# EAGLE design ft231x-breakout-v11-openSX70versionSEEED (EAGLE 9.1.0)
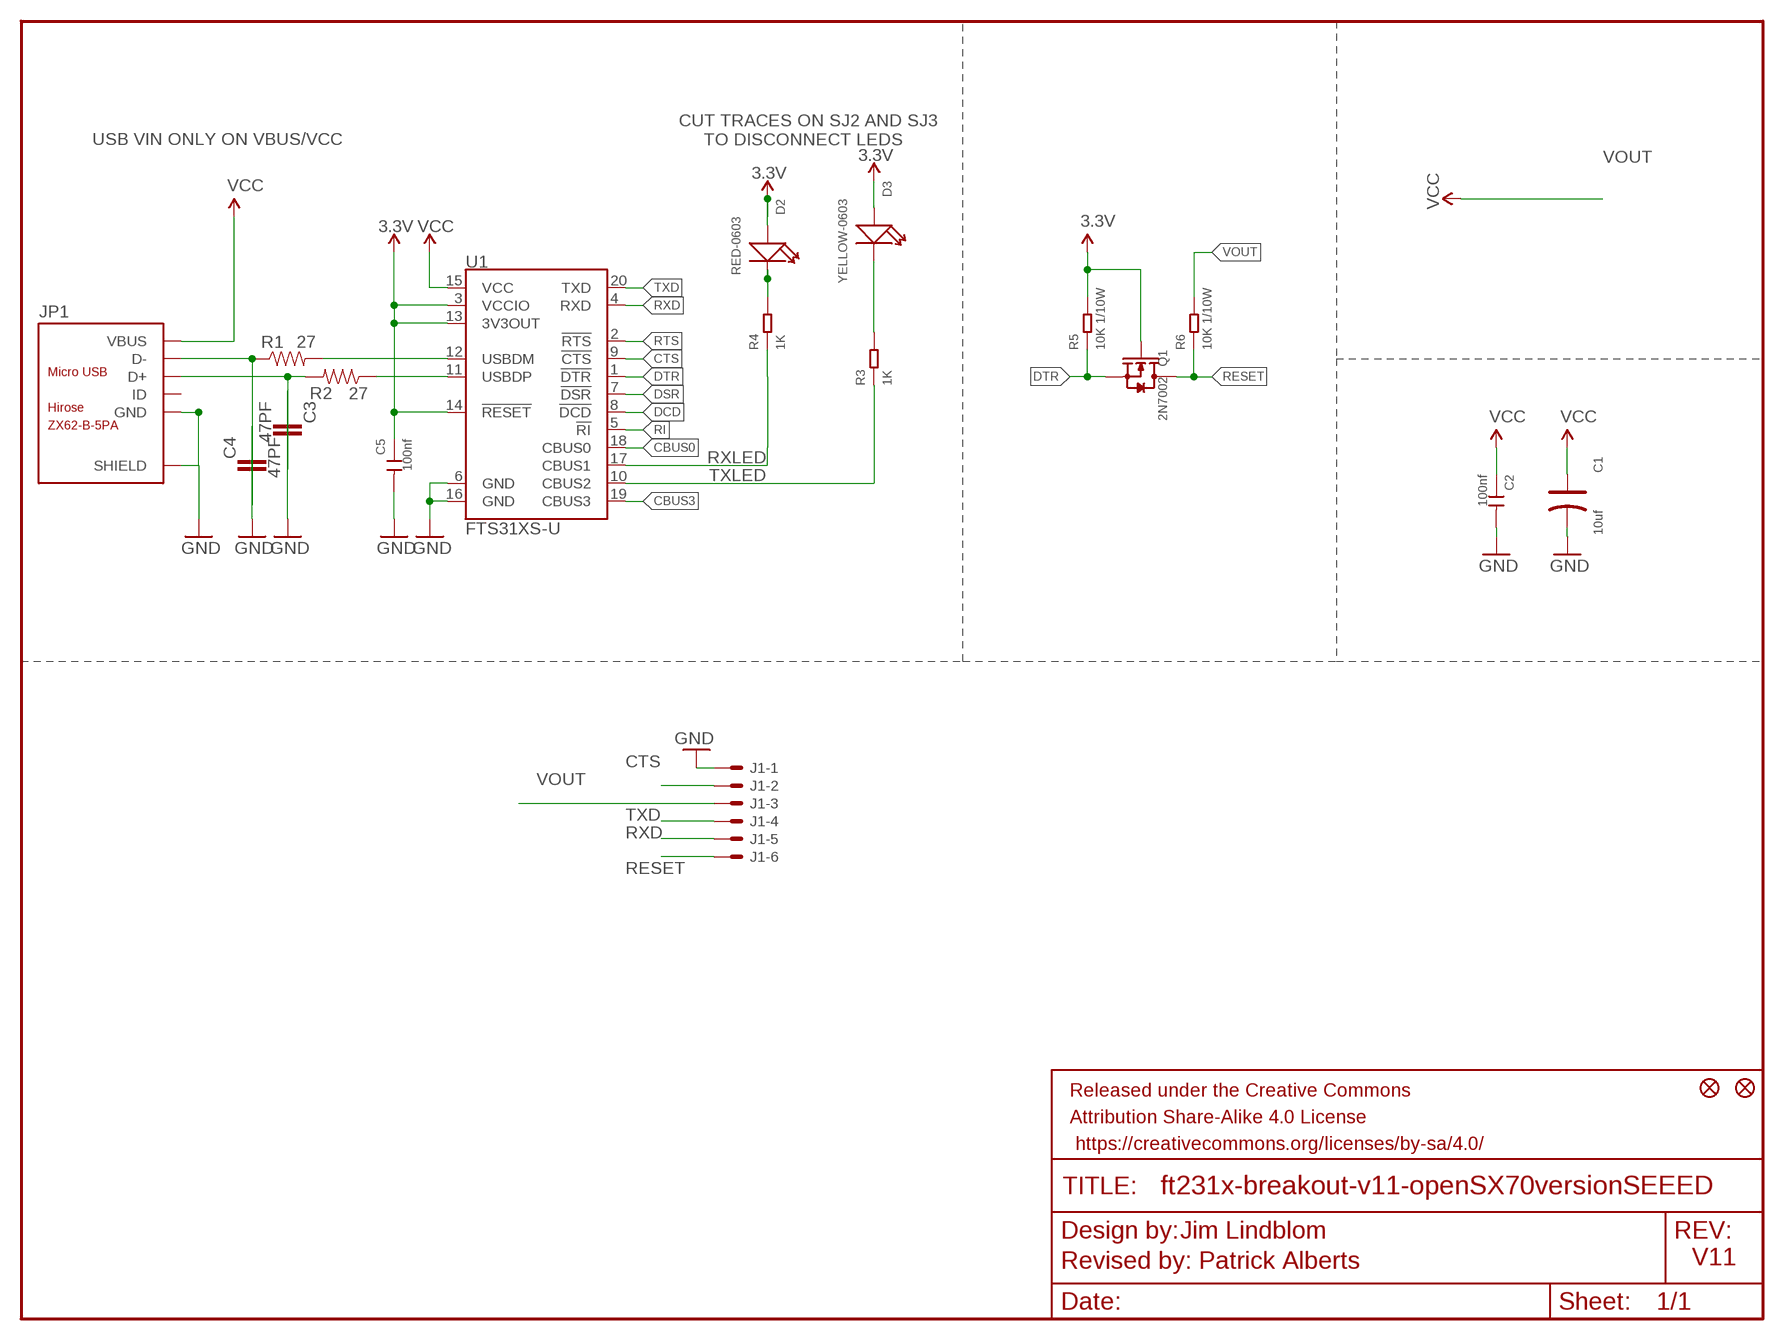
[diagram p0: schematic, sheet 1]

## Parts
C1  10uf  TANTALUM-SMD-10UF-16V-10%(AVX-B)  [AVX-B]
C2  100nf  CERAMIC-100NF-50V-10%-X7R(0603)  [C0603]
C3  47PF  CC0603KRX7R9BB473  [CC0603KRX7R9BB473_CAPC1608X90]
C4  47PF  CC0603KRX7R9BB473  [CC0603KRX7R9BB473_CAPC1608X90]
C5  100nf  CERAMIC-100NF-50V-10%-X7R(0603)  [C0603]
D2  RED-0603  LED-SMD-RED-DIFFUSED(0603)  [LED-0603]
D3  YELLOW-0603  SMD-LED-CLEAR-YELLOW(0603)  [LED-0603]
FRAME1  FRAME-LETTER  [CREATIVE_COMMONS]
J1  XF2L-0625-1  [XF2L-0625-1]
JP1  ZX62-B-5PA  MICRO-USB-SMD(ZX62-B-5PA)  [MICRO-USB5+6P-SMD-0.65-AB]
JP5  FIDUCIAL1X2  [FIDUCIAL-1X2]
JP6  FIDUCIAL1X2  [FIDUCIAL-1X2]
Q1  2N7002  SMD-MOSFET-N-CH-60V-300MA-LOGIC-LEVEL-FET-2N7002(SOT-23)  [SOT-23]
R1  27  27OHM1/10W1%(0603)0603-RES  [0603-RES]
R2  27  27OHM1/10W1%(0603)0603-RES  [0603-RES]
R3  1K  SMD-RES-1K-1%-1/10W(0603)  [R0603]
R4  1K  SMD-RES-1K-1%-1/10W(0603)  [R0603]
R5  10K 1/10W  SMD-RES-10K-5%-1/10W(0603)  [R0603]
R6  10K 1/10W  SMD-RES-10K-5%-1/10W(0603)  [R0603]
U1  FTS31XS-U  FT231XS  [SSOP20_L]

## Nets
3.3V: C5.1 D2.+ D3.+ Q1.1(G) R5.2 U1.3(VCCIO) U1.13(3V3OUT) U1.14(!RESET)
CBUS0: U1.18(CBUS0)
CBUS3: U1.19(CBUS3)
CTS: J1.2 U1.9(!CTS)
DCD: U1.8(!DCD)
DSR: U1.7(!DSR)
DTR: Q1.2(S) R5.1 U1.1(!DTR)
GND: C1.- C2.2 C3.2 C4.2 C5.2 J1.1 JP1.5(GND) JP1.P1(SHIELD) JP1.P2(SHIELD) JP1.P3_1(SHIELD) JP1.P3_2(SHIELD) JP1.P3_3(SHIELD) JP1.P4_1(SHIELD) JP1.P4_2(SHIELD) JP1.P4_3(SHIELD) JP1.P5(SHIELD) JP1.P6(SHIELD) U1.6(GND) U1.16(GND)
N$1: R1.2 U1.12(USBDM)
N$2: R2.1 U1.11(USBDP)
N$3: C3.1 JP1.3(D+) R2.2
N$4: C4.1 JP1.2(D-) R1.1
N$5: D3.- R3.2
N$6: D2.- R4.2
RESET: J1.6 Q1.3(D) R6.1
RI: U1.5(!RI)
RTS: U1.2(!RTS)
RXD: J1.5 U1.4(RXD)
RXLED: R4.1 U1.17(CBUS1)
TXD: J1.4 U1.20(TXD)
TXLED: R3.1 U1.10(CBUS2)
VCC: C1.+ C2.1 JP1.1(VBUS) U1.15(VCC)
VOUT: J1.3 R6.2 ; supply symbol labelled VCC
Unconnected: JP1.4(ID)

## Notes on the sheet
- USB VIN ONLY ON VBUS/VCC
- CUT TRACES ON SJ2 AND SJ3 
       TO DISCONNECT LEDS
- Jim Lindblom
- Revised by: Patrick Alberts | V11

## Library data of the parts
C1 = Seeed-Capacitor-2016:TANTALUM-SMD-10UF-16V-10%(AVX-B): 302020019; MPN: TAJB106K016RNJ
C2 C5 = Seeed-Capacitor:CERAMIC-100NF-50V-10%-X7R(0603): 302010138; MPN: CC0603KRX7R9BB104
C3 C4 = Common-Parts-Library-Eagle:CC0603KRX7R9BB473: 0603 47 nF 50 V ±10 % Tolerance X7R SMT Multilayer Ceramic Capacitor; MANUFACTURER: YAGEO
D2 = Seeed-LED:LED-SMD-RED-DIFFUSED(0603): 304090042; MPN: 19-217-R6C-AL1M2VY-3T
D3 = Seeed-LED:SMD-LED-CLEAR-YELLOW(0603): 304090044; MPN: 19-217-Y5C-AM1N1VY-3T
FRAME1 = SparkFun-Aesthetics:FRAME-LETTER: Schematic Frame Standard 8.5x11 US Letter frame
J1 = con-omron:XF2*-06?: OMRON FPC Connector Source : http://www.omron.com/ecb/products/pdf/fpc.pdf; MF: OMRON COMPONENTS USA; MPN: XF2L-0625-1; OC_FARNELL: 1536105; OC_NEWARK: 29C7842
JP1 = Seeed-Connector:MICRO-USB-SMD(ZX62-B-5PA): 320010005; MPN: ZX62-B-5PA
JP5 JP6 = SparkFun-Aesthetics:FIDUCIAL: Fiducial Alignment Points Various fiducial points for machine vision alignment.
Q1 = Seeed-Transistor:SMD-MOSFET-N-CH-60V-300MA-LOGIC-LEVEL-FET-2N7002(SOT-23): 305030028; MPN: 2N7002,215
R1 R2 = SparkFun-Resistors:27OHM1/10W1%(0603): RES-09334; PROD_ID: RES-09334
R3 R4 = Seeed-Resistor-2016:SMD-RES-1K-1%-1/10W(0603): 301010298; MPN: RC0603FR-071KL
R5 R6 = Seeed-Resistor:SMD-RES-10K-5%-1/10W(0603): 301010293; MPN: RC0603JR-0710KL
U1 = SparkFun-DigitalIC:FT231X: FTDI FT231X Full Speed USB to Full-handshake UART This USB2.0 Full Speed IC offers a compact bridge to full handshake UART interfaces. The device is a UART, capable of operating up to 3MBaud, with low power consumption (8mA). The FT231X includes the complete FT-X series feature set and enables USB to be added into a system design quickly and easily over a UART interface.; PROD_ID: IC-11524

## Board
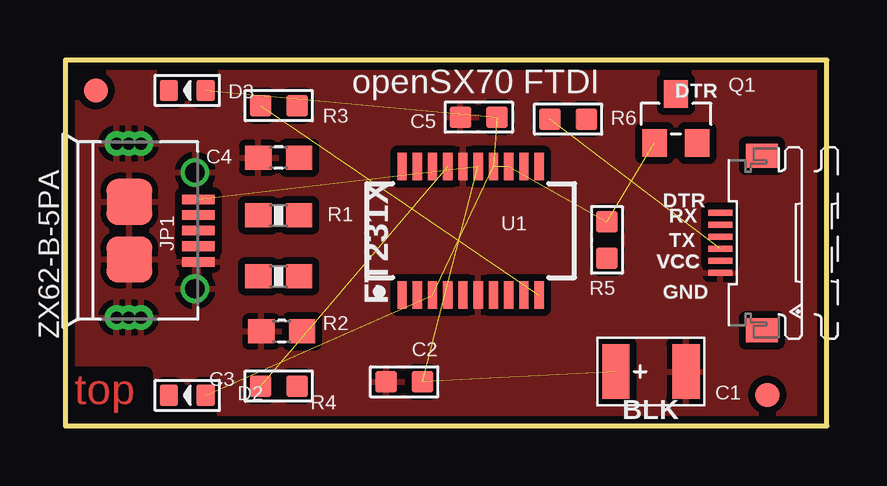
[diagram p1: board, top side]
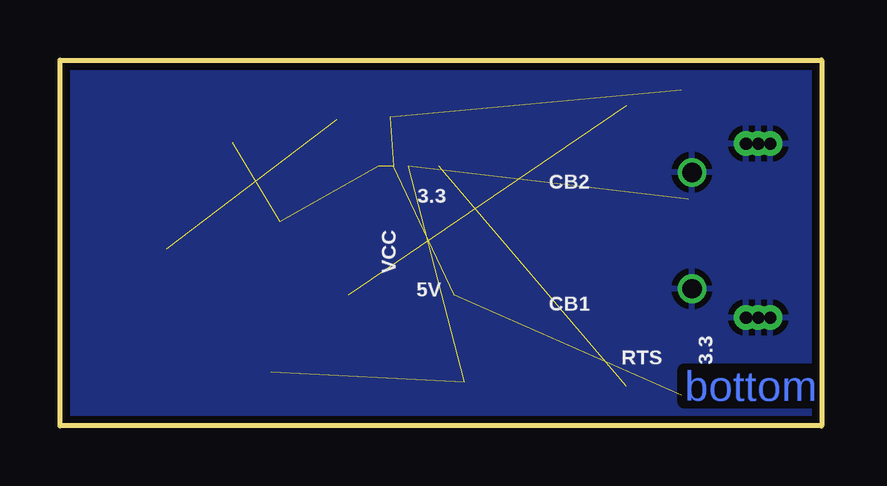
[diagram p2: board, bottom side, seen from below]

Size 31.75 x 15.24 mm. Coordinates in mm from the lower left corner, seen from the top.
Outline: 0,15.24 0,0 31.75,0 31.75,15.24 0,15.24
Copper layers (1*16): Top 0.035mm / dielectric 1.5mm / Bottom 0.035mm
Design rules "SparkFun-2-layer-TIGHT": minimum track width 7mil, minimum drill 15mil, track to track 7mil, track to pad 7mil, pad to pad 7mil, via to via 7mil, smd to smd 7mil, copper to edge 7mil, drill to drill 7mil, minimum pad ring 7mil, minimum via ring 7mil, stop-mask expansion 4mil, vias tented up to drill 20mil, thermal gap 10mil

### Footprints (pad centres in the part's own frame; a part is rotated, then mirrored left to right if it is on the bottom)
AVX-B = smd 1.143 x 2.286: + -1.46,0; - 1.46,0
C0603 = smd 0.889 x 0.889: 1 0,0.762; 2 0,-0.762
CC0603KRX7R9BB473_CAPC1608X90 = smd 1.1 x 1: 1 -0.85,0; 2 0.85,0
LED-0603 = smd 0.762 x 0.889: + -0.762,0; - 0.762,0
XF2L-0625-1 = smd 1 x 0.25: 1 1.905,1.25; 2 1.905,0.75; 3 1.905,0.25; 4 1.905,-0.25; 5 1.905,-0.75; 6 1.905,-1.25 | smd 1.34 x 1: M1 0.18,3.638; M2 0.18,-3.638
MICRO-USB5+6P-SMD-0.65-AB = smd 0.4 x 1.35: 1 -1.3,2.875; 2 -0.65,2.875; 3 0,2.875; 4 0.65,2.875; 5 1.3,2.875 | smd 1.9 x 1.9: P1 -1.2,0; P2 1.2,0 | drill 0.508 pad 1.016: P3_1 -3.625,-0.533; P3_2 -3.625,-0.025; P3_3 -3.625,0.483; P4_1 3.625,-0.533; P4_2 3.625,-0.025; P4_3 3.625,0.483 | drill 0.8: P5 -2.425,2.73; P6 2.425,2.73
FIDUCIAL-1X2 = smd 1 x 1: 1 0,0
SOT-23 = smd 1.016 x 1.143: 1 -0.889,-1.016; 2 0.889,-1.016; 3 0,1.016
0603-RES = smd 1.1 x 1: 1 -0.85,0; 2 0.85,0
R0603 = smd 0.889 x 0.889: 1 0,0.762; 2 0,-0.762
SSOP20_L = smd 0.381 x 1.143: 1 -2.857,-2.68; 2 -2.223,-2.68; 3 -1.587,-2.68; 4 -0.953,-2.68; 5 -0.318,-2.68; 6 0.318,-2.68; 7 0.953,-2.68; 8 1.587,-2.68; 9 2.223,-2.68; 10 2.857,-2.68; 11 2.857,2.68; 12 2.223,2.68; 13 1.587,2.68; 14 0.953,2.68; 15 0.318,2.68; 16 -0.318,2.68; 17 -0.953,2.68; 18 -1.587,2.68; 19 -2.223,2.68; 20 -2.857,2.68

### Placement (x,y rotation side)
C1  24.41,2.26 0 top
C2  14.12,1.83 270 top
C3  9.02,3.94 180 top
C4  8.89,11.18 180 top
C5  17.23,12.86 270 top
D2  5.08,1.27 180 top
D3  5.08,13.97 180 top
FRAME1  -10.16,-11.43 0 top  (outside the outline)
J1  29.21,7.62 180 top
JP1  2.67,8.13 270 top
JP5  29.26,1.28 0 top
JP6  1.27,13.97 0 top
Q1  25.45,12.8 0 top
R1  8.89,8.76 0 top
R2  8.89,6.22 180 top
R3  8.89,13.34 90 top
R4  8.89,1.65 90 top
R5  22.58,7.75 180 top
R6  20.95,12.78 270 top
U1  16.89,8.13 0 top

### Tracks (layer width: path | path; a pad name or v marks a point on that pad's centre or on a via)
3.3V  (7 unrouted)
GND
  pour Top (isolate 0.305): 0,15.24 0,0 31.75,0 31.75,15.24
  pour Bottom (isolate 0.305): 0,15.24 0,0 31.75,0 31.75,15.24
RXLED  (1 unrouted)
TXLED  (1 unrouted)
VCC  (3 unrouted)
VOUT  (1 unrouted)

### Text on the board
Top: top
Bottom: bottom
tPlace: openSX70 FTDI | DTR | DTR | RX | FT231X | TX | VCC | VCC | GND | BLK
bPlace: CB2 | 3.3 | 5V | VCC | CB1 | 3.3 | RTS
tDocu: J. Lindblom | Revised by: Patrick Alberts